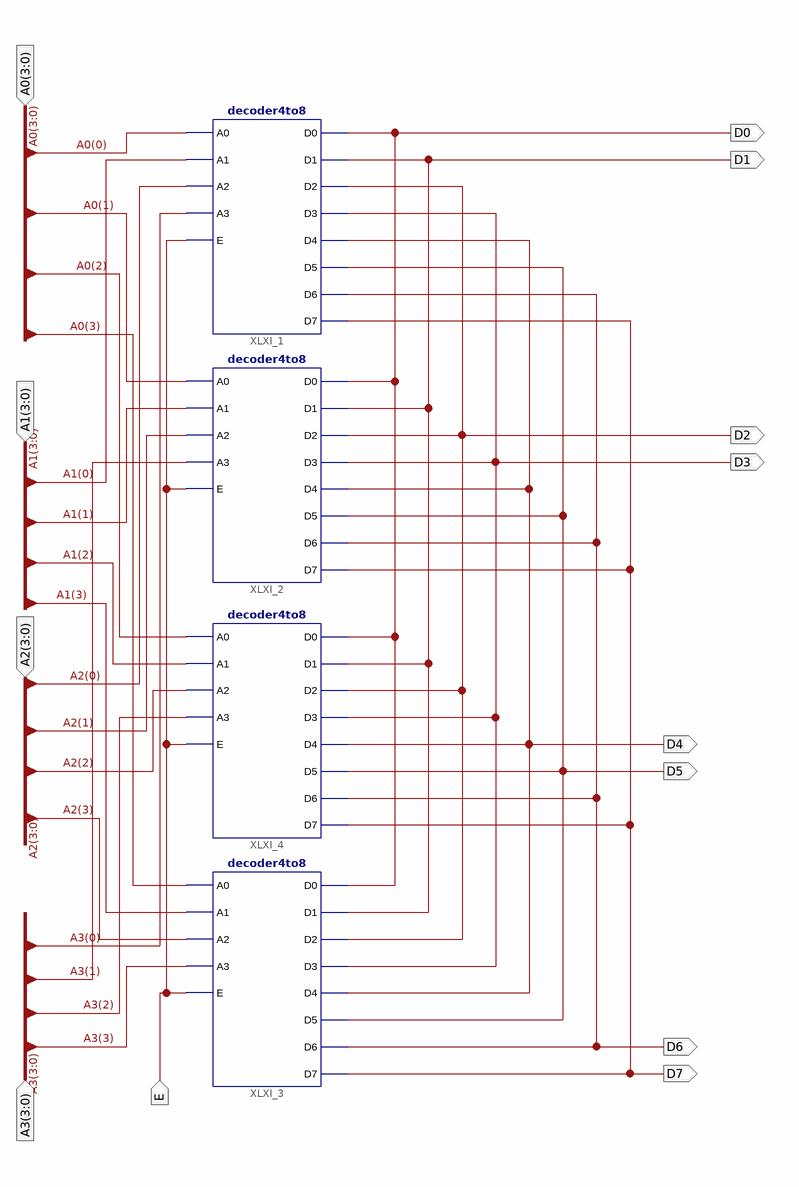
[diagram p0: schematic sheet 1]
// Xilinx ISE schematic decoder4X4to8.sch (spartan3e) as structural Verilog: 4 symbols, 13 ports
module decoder4X4to8 (
  input  [3:0] A0,
  input  [3:0] A1,
  input  [3:0] A2,
  input  [3:0] A3,
  input  E,
  output D0,
  output D1,
  output D2,
  output D3,
  output D4,
  output D5,
  output D6,
  output D7
);

  decoder4to8 XLXI_1 (
    .A0(A0[0]), .A1(A1[0]), .A2(A2[0]), .A3(A3[0]), .D0(D0), .D1(D1), .D2(D2), .D3(D3), .D4(D4), .D5(D5),
    .D6(D6), .D7(D7), .E(E));
  decoder4to8 XLXI_2 (
    .A0(A0[1]), .A1(A1[1]), .A2(A2[1]), .A3(A3[1]), .D0(D0), .D1(D1), .D2(D2), .D3(D3), .D4(D4), .D5(D5),
    .D6(D6), .D7(D7), .E(E));
  decoder4to8 XLXI_3 (
    .A0(A0[3]), .A1(A1[3]), .A2(A2[3]), .A3(A3[3]), .D0(D0), .D1(D1), .D2(D2), .D3(D3), .D4(D4), .D5(D5),
    .D6(D6), .D7(D7), .E(E));
  decoder4to8 XLXI_4 (
    .A0(A0[2]), .A1(A1[2]), .A2(A2[2]), .A3(A3[2]), .D0(D0), .D1(D1), .D2(D2), .D3(D3), .D4(D4), .D5(D5),
    .D6(D6), .D7(D7), .E(E));
endmodule
